# EAGLE design Voltage Regulator (EAGLE 9.4.2)
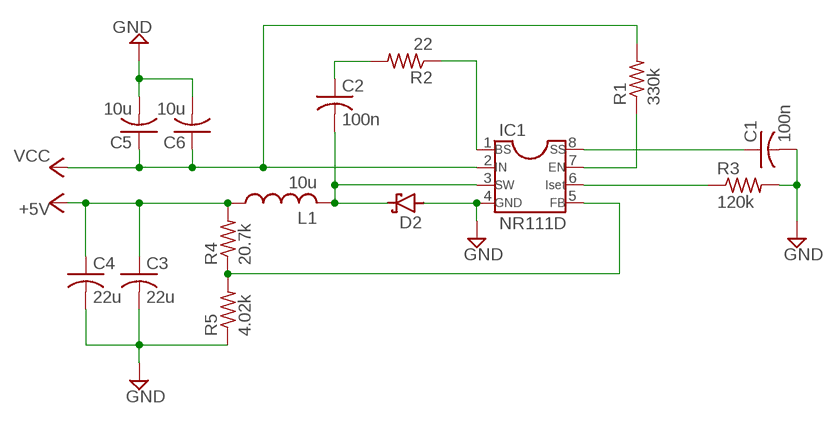
[diagram p0: schematic, sheet 1]

## Parts
C1  100n  C-US050-024X044  [C050-024X044]
C2  100n  C-US050-024X044  [C050-024X044]
C3  22u  C-US025-024X044  [C025-024X044]
C4  22u  C-US025-024X044  [C025-024X044]
C5  10u  C-US025-024X044  [C025-024X044]
C6  10u  C-US025-024X044  [C025-024X044]
D2  SCHOTTKY-DIODEC4111-15  [C4111-15]
IC1  NR111D  DIL8  [DIL08]
L1  10u  WURTHINDUCTOR1  [INDRD650W105D880H1100B]
R1  330k  R-US_0204/7  [0204/7]
R2  22  R-US_0204/7  [0204/7]
R3  120k  R-US_0204/7  [0204/7]
R4  20.7k  R-US_0204/7  [0204/7]
R5  4.02k  R-US_0204/7  [0204/7]

## Nets
+5V: C3.1 C4.1 L1.1 R4.2
GND: C1.2 C3.2 C4.2 C5.2 C6.2 D2.A IC1.4(GND) R3.2 R5.1
N$1: IC1.5(FB) R4.1 R5.2
N$2: IC1.1(BS) R2.1
N$7: IC1.7(EN) R1.1
N$8: C2.2 D2.C IC1.3(SW) L1.2
N$10: C2.1 R2.2
N$11: C1.1 IC1.8(SS)
N$13: IC1.6(ISET) R3.1
VCC: C5.1 C6.1 IC1.2(IN) R1.2

## Library data of the parts
C1-C6 = rcl:C-US: CAPACITOR, American symbol; SPICEPREFIX: C
D2 = diode:SCHOTTKY-DIODE: Schottky Diode
IC1 = NR111D:DIL8: Dual In Line / Socket
L1 = NR111D:WURTHINDUCTOR
R1-R5 = rcl:R-US_: RESISTOR, American symbol; SPICEPREFIX: R

## Board
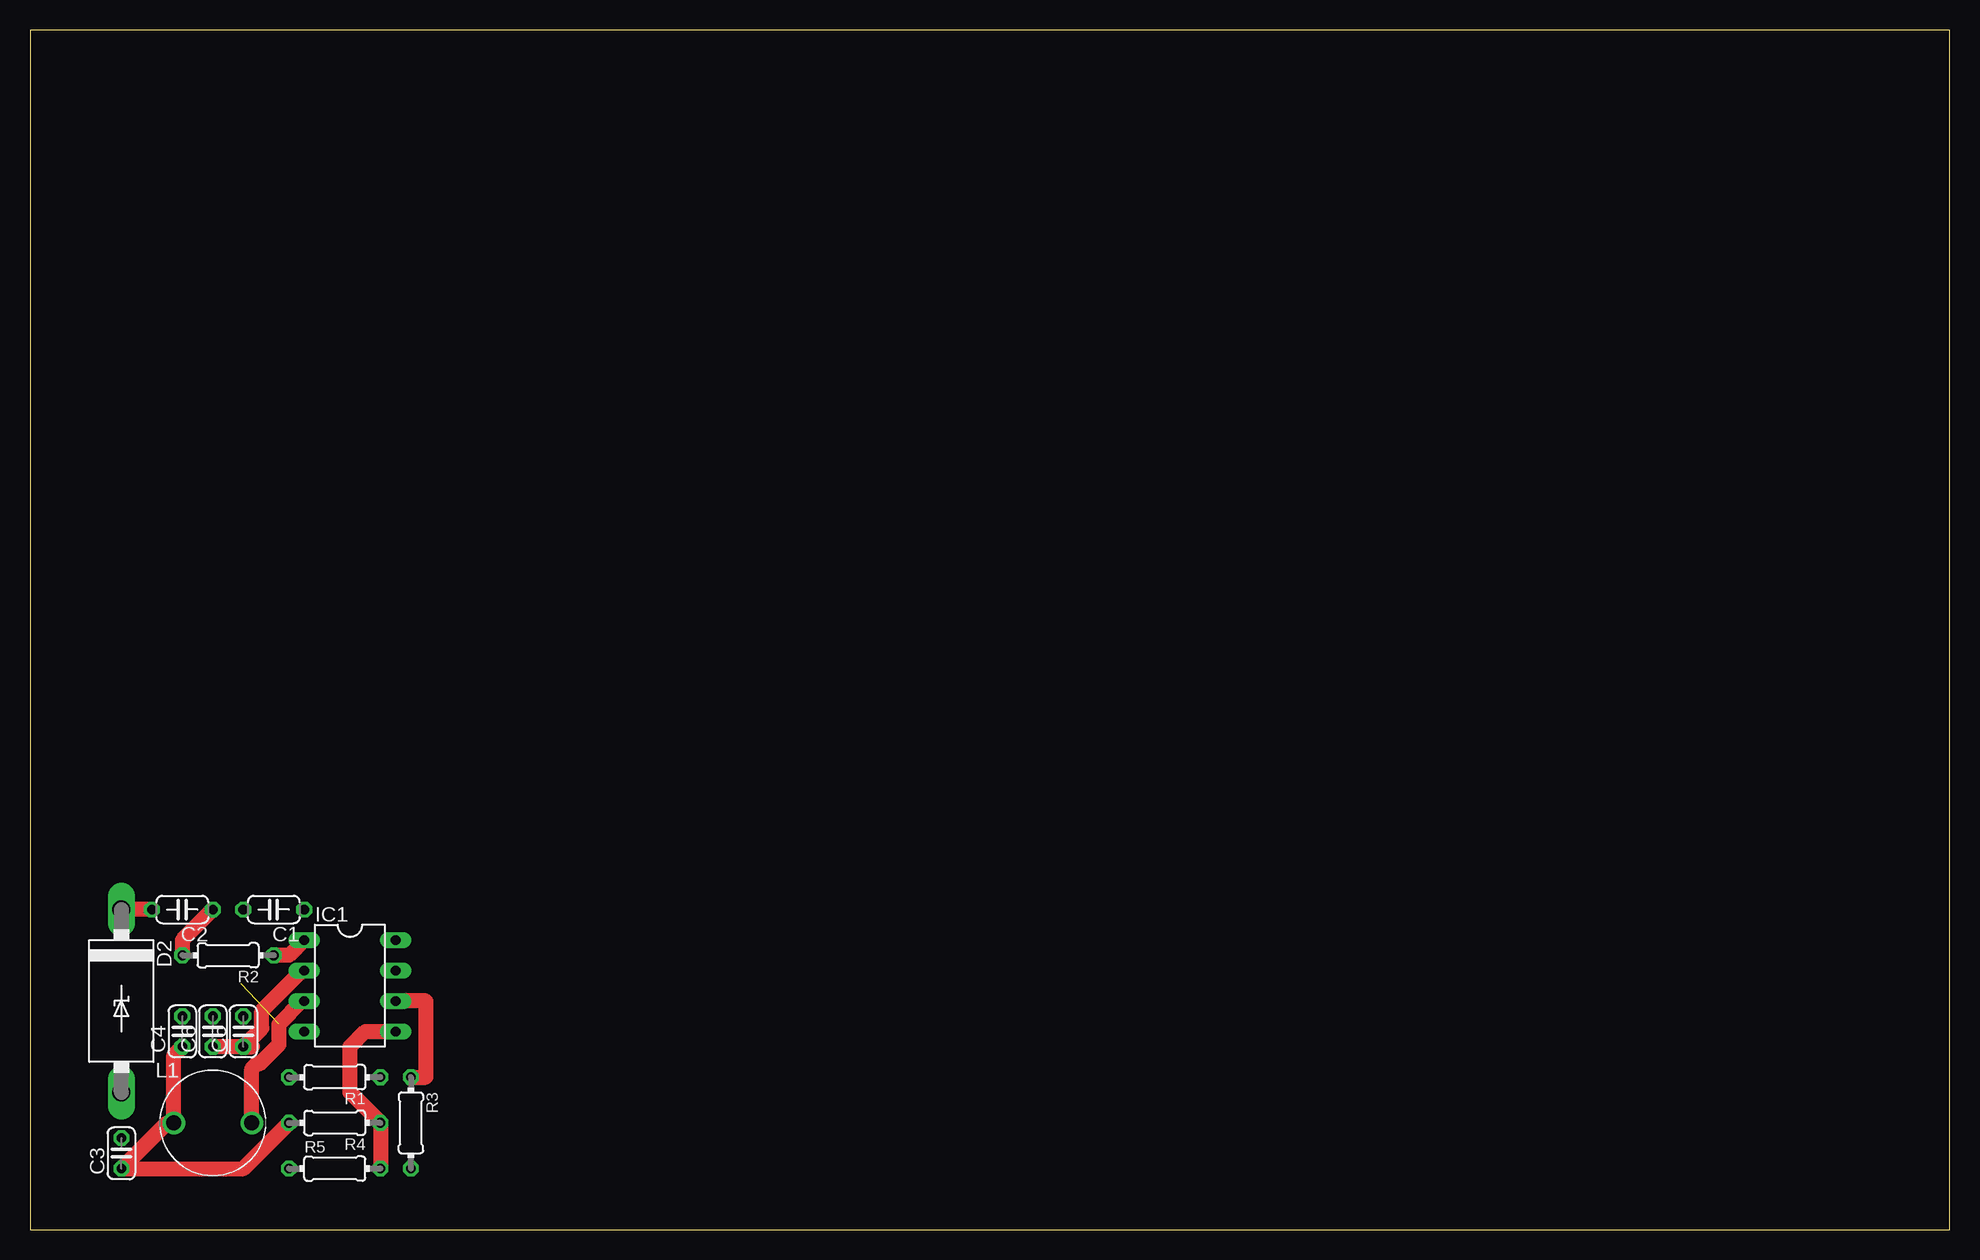
[diagram p1: board, top side]
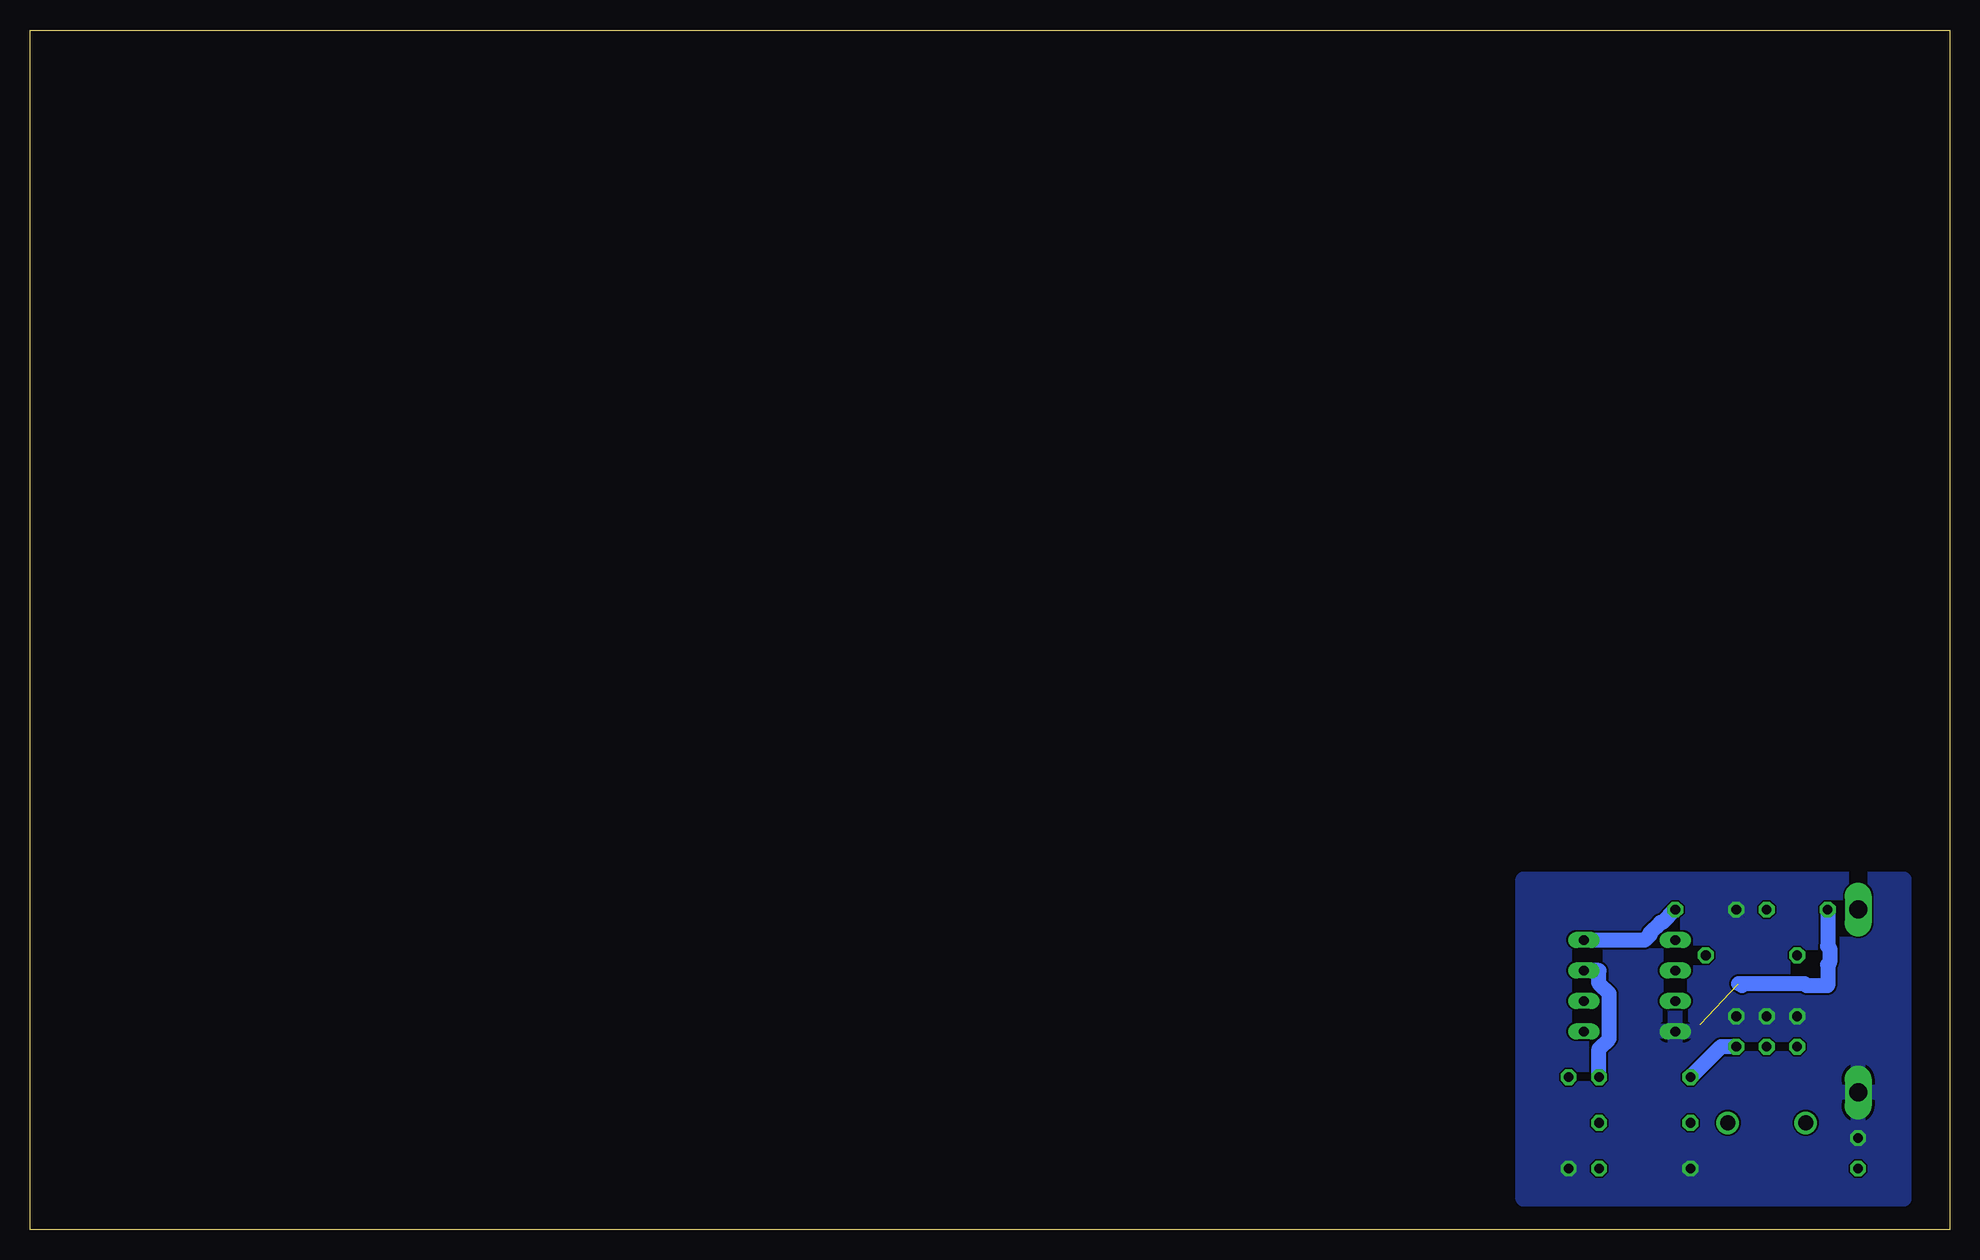
[diagram p2: board, bottom side, seen from below]

Size 160 x 100 mm. Coordinates in mm from the lower left corner, seen from the top.
Outline: 0,0 160,0 160,100 0,100 0,0
Copper layers (1*16): Top 0.035mm / dielectric 1.5mm / Bottom 0.035mm
Design rules "default": minimum track width 6mil, minimum drill 0.35mm, track to track 6mil, track to pad 6mil, pad to pad 6mil, via to via 6mil, smd to smd 6mil, copper to edge 40mil, drill to drill 6mil, minimum pad ring 10mil, minimum via ring 8mil, stop-mask expansion 4mil, vias tented up to drill 0mil, thermal gap 10mil

### Footprints (pad centres in the part's own frame; a part is rotated, then mirrored left to right if it is on the bottom)
C050-024X044 = drill 0.813 octagon: 1 -2.54,0; 2 2.54,0
C025-024X044 = drill 0.813 octagon: 1 -1.27,0; 2 1.27,0
C4111-15 = drill 1.499 long: A 7.62,0; C -7.62,0
DIL08 = drill 0.813 long: 1 -3.81,-3.81; 2 -1.27,-3.81; 3 1.27,-3.81; 4 3.81,-3.81; 5 3.81,3.81; 6 1.27,3.81; 7 -1.27,3.81; 8 -3.81,3.81
INDRD650W105D880H1100B = drill 1.25 pad 1.875: 1 -3.25,0; 2 3.25,0
0204/7 = drill 0.813 octagon: 1 -3.81,0; 2 3.81,0

### Placement (x,y rotation side)
C1  20.32,26.67 180 top
C2  12.7,26.67 180 top
C3  7.62,6.35 90 top
C4  12.7,16.51 90 top
C5  17.78,16.51 90 top
C6  15.24,16.51 90 top
D2  7.62,19.05 270 top
IC1  26.67,20.32 270 top
L1  15.24,8.89 0 top
R1  25.4,12.7 180 top
R2  16.51,22.86 180 top
R3  31.75,8.89 270 top
R4  25.4,8.89 180 top
R5  25.4,5.08 0 top

### Tracks (layer width: path | path; a pad name or v marks a point on that pad's centre or on a via)
+5V
  Top 1.27: R4.2 17.78,5.08 C3.1 11.43,8.89 L1.1 11.99,14.53 C4.1
GND
  pour Bottom: 3.81,29.21 3.81,2.54 35.56,2.54 35.56,29.21
N$1
  Top 1.27: R5.2 R4.1 26.67,11.43 26.67,15.24 27.94,16.51 IC1.5
N$2
  Top 1.27: IC1.1 21.59,22.86 R2.1
N$7
  Bottom 1.27: IC1.7 29.21,21.59 29.21,20.49 28.37,19.65 28.37,15.91 29.21,15.07 R1.1
N$8  (1 unrouted)
  Top 1.27: C2.2 D2.C | L1.2 18.49,13.41 18.9,13.82 19.15,13.82 20.75,15.42 20.75,17.11 22.69,19.05 IC1.3
  Bottom 1.27: C2.2 10.16,23.64 9.98,23.46 9.98,22.26 10.16,22.08 10.16,20.32 11.92,20.32 12.1,20.5 17.11,20.5 | 17.11,20.5 17.29,20.32 | 17.11,20.5 17.6,20.5
N$10
  Top 1.27: C2.1 12.7,24.13 R2.2
N$11
  Bottom 1.27: IC1.8 25.4,24.13 24.97,24.56 24.97,24.73 24.12,25.58 23.95,25.58 C1.1
N$13
  Top 1.27: R3.1 33.02,12.7 33.02,19.05 IC1.6
VCC
  Top 1.27: IC1.2 22.69,21.59 19.33,18.23 19.33,16.79 C5.1 | C5.1 C6.1 | C5.1 18.56,15.24
  Bottom 1.27: R1.2 19.05,15.24 C5.1